# EAGLE design ledcontroller (EAGLE 5.11)
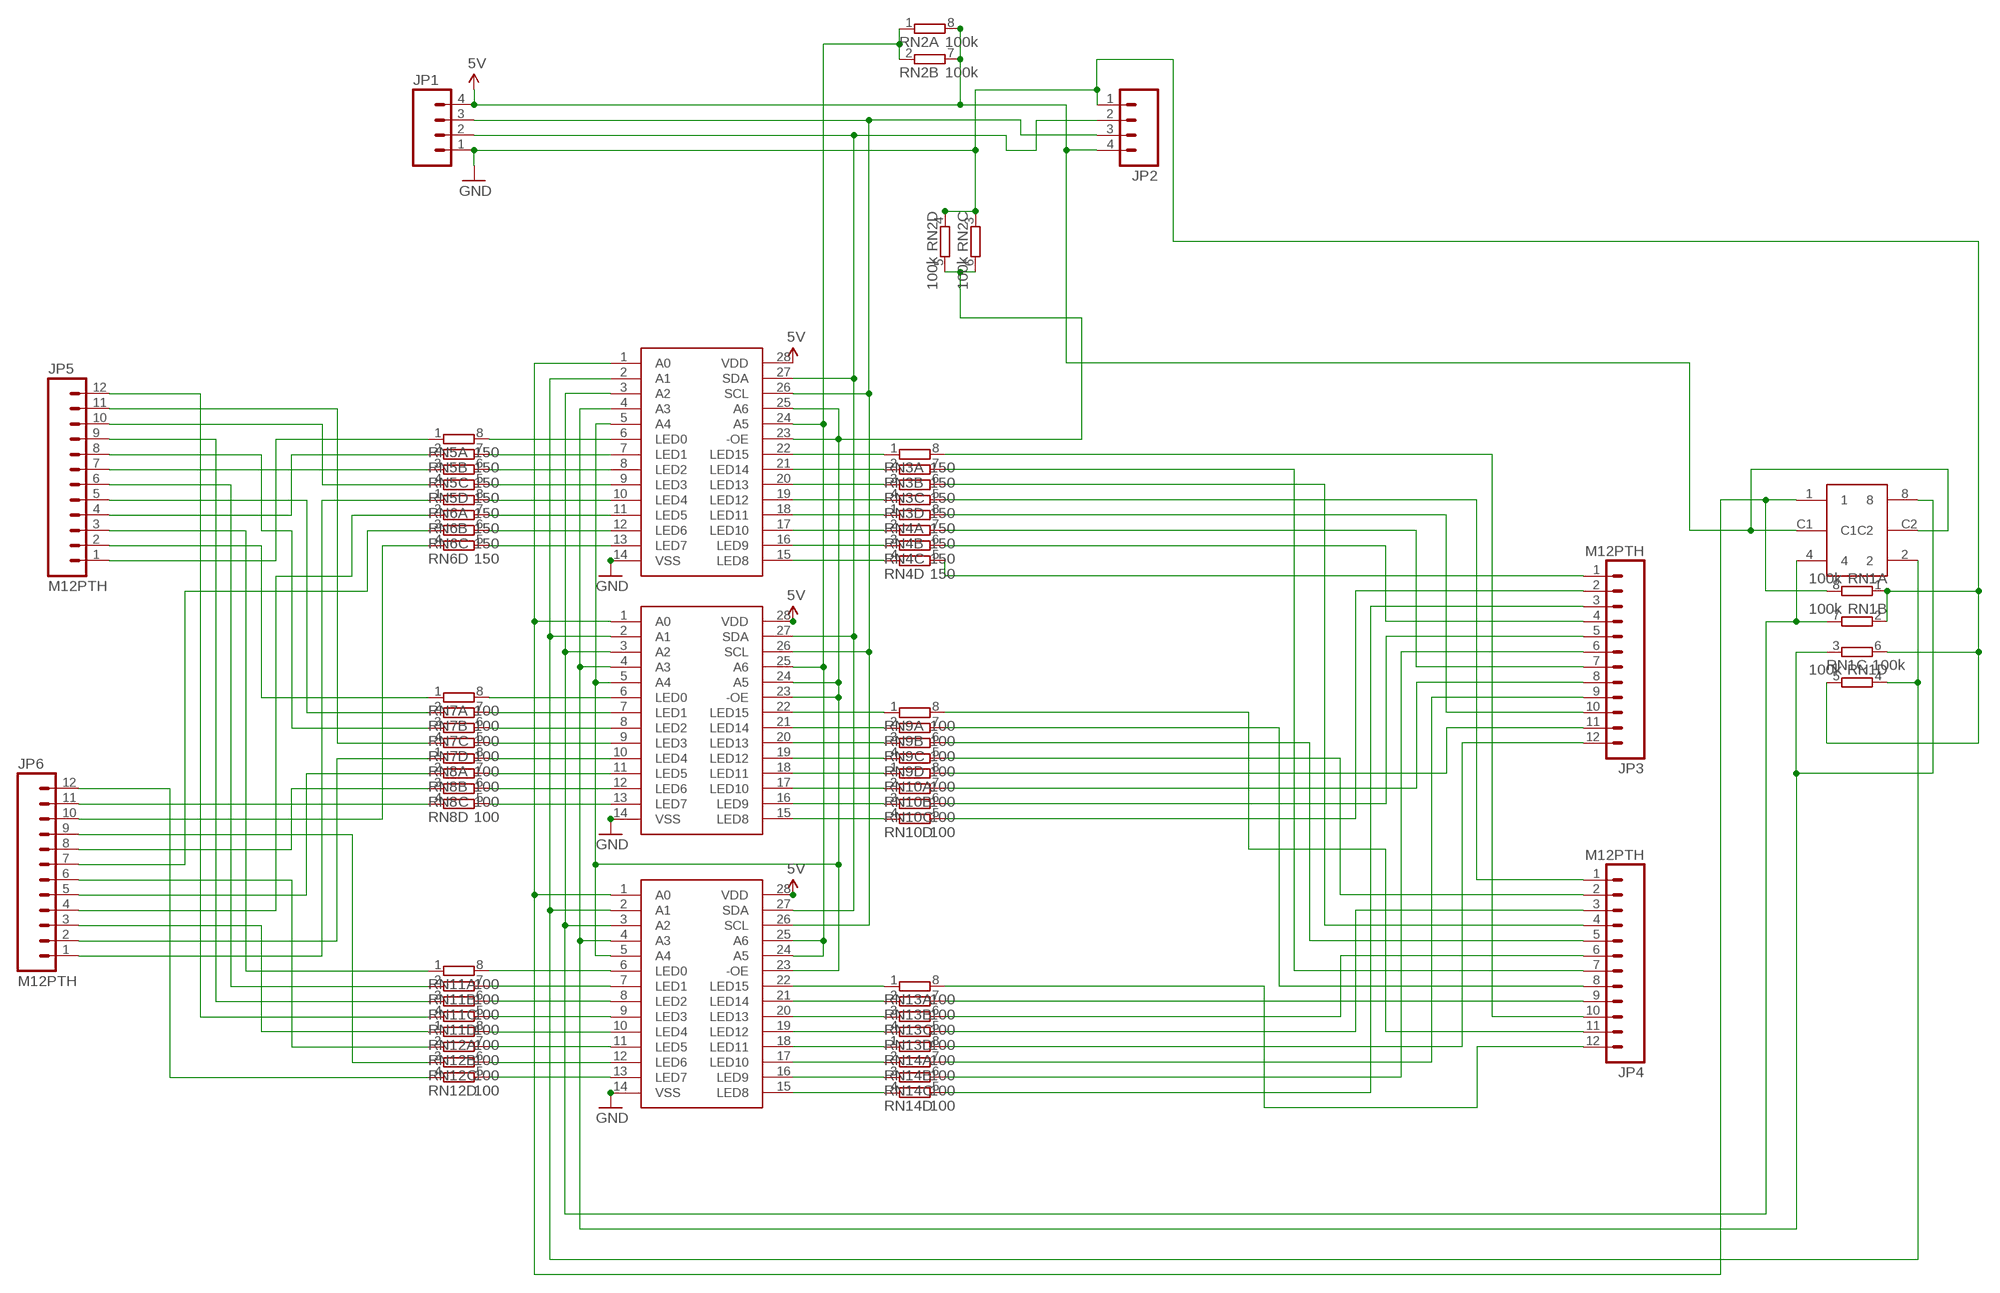
[diagram p0: schematic, sheet 1]

## Parts
DRV_B  PCA9635PWPCA9635PW  [TSSOP28]
DRV_G  PCA9635PWPCA9635PW  [TSSOP28]
DRV_R  PCA9635PWPCA9635PW  [TSSOP28]
JP1  M04PTH  [1X04]
JP2  M04PTH  [1X04]
JP3  M12PTH  [1X12]
JP4  M12PTH  [1X12]
JP5  M12PTH  [1X12]
JP6  M12PTH  [1X12]
RN1  100k  4R-NCAY16  [CAY16]
RN2  100k  4R-NCAY16  [CAY16]
RN3  150  4R-NCAY16  [CAY16]
RN4  150  4R-NCAY16  [CAY16]
RN5  150  4R-NCAY16  [CAY16]
RN6  150  4R-NCAY16  [CAY16]
RN7  100  4R-NCAY16  [CAY16]
RN8  100  4R-NCAY16  [CAY16]
RN9  100  4R-NCAY16  [CAY16]
RN10  100  4R-NCAY16  [CAY16]
RN11  100  4R-NCAY16  [CAY16]
RN12  100  4R-NCAY16  [CAY16]
RN13  100  4R-NCAY16  [CAY16]
RN14  100  4R-NCAY16  [CAY16]
U$4  P36ROTARY  [P36ROTARY-SMD]

## Nets
5V [power]: DRV_B.28(VDD) DRV_G.28(VDD) DRV_R.28(VDD) JP1.4 JP2.4 RN2.7 RN2.8 U$4.C1 U$4.C2
B0: JP5.3 RN11.1
B1: JP5.6 RN11.2
B2: JP5.9 RN11.3
B3: JP5.12 RN11.4
B4: JP6.3 RN12.1
B5: JP6.6 RN12.2
B6: JP6.9 RN12.3
B7: JP6.12 RN12.4
B8: JP3.3 RN14.5
B9: JP3.6 RN14.6
B10: JP3.9 RN14.7
B11: JP3.12 RN14.8
B12: JP4.3 RN13.5
B13: JP4.6 RN13.6
B14: JP4.9 RN13.7
B15: JP4.12 RN13.8
BCD_1: DRV_B.1(A0) DRV_G.1(A0) DRV_R.1(A0) RN1.8 U$4.1
BCD_2: DRV_B.2(A1) DRV_G.2(A1) DRV_R.2(A1) RN1.4 U$4.2
BCD_4: DRV_B.3(A2) DRV_G.3(A2) DRV_R.3(A2) RN1.7 U$4.4
BCD_8: DRV_B.4(A3) DRV_G.4(A3) DRV_R.4(A3) RN1.3 U$4.8
G0: JP5.2 RN7.1
G1: JP5.5 RN7.2
G2: JP5.8 RN7.3
G3: JP5.11 RN7.4
G4: JP6.2 RN8.1
G5: JP6.5 RN8.2
G6: JP6.8 RN8.3
G7: JP6.11 RN8.4
G8: JP3.2 RN10.5
G9: JP3.5 RN10.6
G10: JP3.8 RN10.7
G11: JP3.11 RN10.8
G12: JP4.2 RN9.5
G13: JP4.5 RN9.6
G14: JP4.8 RN9.7
G15: JP4.11 RN9.8
GND [power]: DRV_B.14(VSS) DRV_G.14(VSS) DRV_R.14(VSS) JP1.1 JP2.1 RN1.1 RN1.2 RN1.5 RN1.6 RN2.3 RN2.4
N$1: DRV_R.6(LED0) RN5.8
N$2: DRV_R.7(LED1) RN5.7
N$3: DRV_R.8(LED2) RN5.6
N$4: DRV_R.9(LED3) RN5.5
N$5: DRV_R.10(LED4) RN6.8
N$6: DRV_R.11(LED5) RN6.7
N$7: DRV_R.12(LED6) RN6.6
N$8: DRV_R.13(LED7) RN6.5
N$9: DRV_R.22(LED15) RN3.1
N$10: DRV_R.21(LED14) RN3.2
N$11: DRV_R.20(LED13) RN3.3
N$12: DRV_R.19(LED12) RN3.4
N$17: DRV_G.6(LED0) RN7.8
N$18: DRV_G.8(LED2) RN7.6
N$19: DRV_G.7(LED1) RN7.7
N$20: DRV_G.9(LED3) RN7.5
N$21: DRV_G.10(LED4) RN8.8
N$22: DRV_G.11(LED5) RN8.7
N$23: DRV_G.12(LED6) RN8.6
N$24: DRV_G.13(LED7) RN8.5
N$25: DRV_G.22(LED15) RN9.1
N$26: DRV_G.21(LED14) RN9.2
N$27: DRV_G.20(LED13) RN9.3
N$28: DRV_G.19(LED12) RN9.4
N$29: DRV_G.18(LED11) RN10.1
N$30: DRV_G.17(LED10) RN10.2
N$31: DRV_G.16(LED9) RN10.3
N$32: DRV_G.15(LED8) RN10.4
N$33: DRV_B.22(LED15) RN13.1
N$34: DRV_B.21(LED14) RN13.2
N$35: DRV_B.20(LED13) RN13.3
N$36: DRV_B.19(LED12) RN13.4
N$37: DRV_B.18(LED11) RN14.1
N$38: DRV_B.17(LED10) RN14.2
N$39: DRV_B.16(LED9) RN14.3
N$40: DRV_B.15(LED8) RN14.4
N$41: DRV_B.6(LED0) RN11.8
N$42: DRV_B.7(LED1) RN11.7
N$43: DRV_B.8(LED2) RN11.6
N$44: DRV_B.9(LED3) RN11.5
N$45: DRV_B.10(LED4) RN12.8
N$46: DRV_B.11(LED5) RN12.7
N$47: DRV_B.12(LED6) RN12.6
N$48: DRV_B.13(LED7) RN12.5
PULL-DOWN: DRV_B.5(A4) DRV_B.23(-OE) DRV_G.5(A4) DRV_G.23(-OE) DRV_G.24(A5) DRV_R.5(A4) DRV_R.23(-OE) DRV_R.25(A6) RN2.5 RN2.6
PULL-UP: DRV_B.24(A5) DRV_B.25(A6) DRV_G.25(A6) DRV_R.24(A5) RN2.1 RN2.2
R0: JP5.1 RN5.1
R1: JP5.4 RN5.2
R2: JP5.7 RN5.3
R3: JP5.10 RN5.4
R4: JP6.1 RN6.1
R5: JP6.4 RN6.2
R6: JP6.7 RN6.3
R7: JP6.10 RN6.4
R8: JP3.1 RN4.5
R9: JP3.4 RN4.6
R10: JP3.7 RN4.7
R11: JP3.10 RN4.8
R12: JP4.1 RN3.5
R13: JP4.4 RN3.6
R14: JP4.7 RN3.7
R15: JP4.10 RN3.8
RO8: DRV_R.15(LED8) RN4.4
RO9: DRV_R.16(LED9) RN4.3
RO10: DRV_R.17(LED10) RN4.2
RO11: DRV_R.18(LED11) RN4.1
SCL: DRV_B.26(SCL) DRV_G.26(SCL) DRV_R.26(SCL) JP1.3 JP2.3
SDA: DRV_B.27(SDA) DRV_G.27(SDA) DRV_R.27(SDA) JP1.2 JP2.2

## Library data of the parts
DRV_B DRV_G DRV_R = SparkFun:PCA9635PW: 16ch PWM led driver, 2.3-5.5V
JP1 JP2 = SparkFun:M04: Header 4 Standard 4-pin 0.1" header. Use with straight break away headers (SKU : PRT-00116), right angle break away headers (PRT-00553), swiss pins (PRT-00743), machine pins (PRT-00117), and female headers (PRT-00115). Molex polarized connector foot print use with SKU : PRT-08231 with associated crimp pins and housings.
JP3-JP6 = SparkFun:M12: Header 12 Standard 12-pin 0.1" header. Use with straight break away headers (SKU : PRT-00116), right angle break away headers (PRT-00553), swiss pins (PRT-00743), machine pins (PRT-00117), and female headers (PRT-00115).
RN1-RN14 = resistor-dil:4R-N: Array Chip Resistor Source: RS Component / Phycomp; OC_FARNELL: unknown; OC_NEWARK: unknown
U$4 = SparkFun:P36ROTARY: P36 BCD rotary switch

## Board
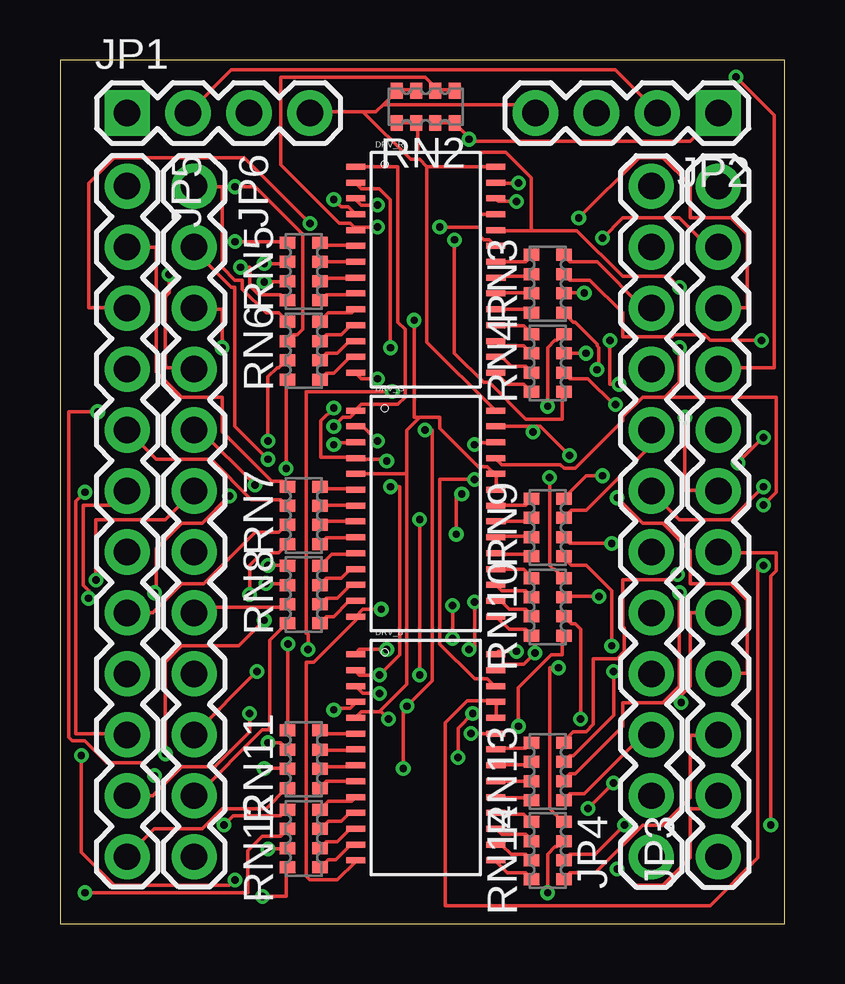
[diagram p1: board, top side]
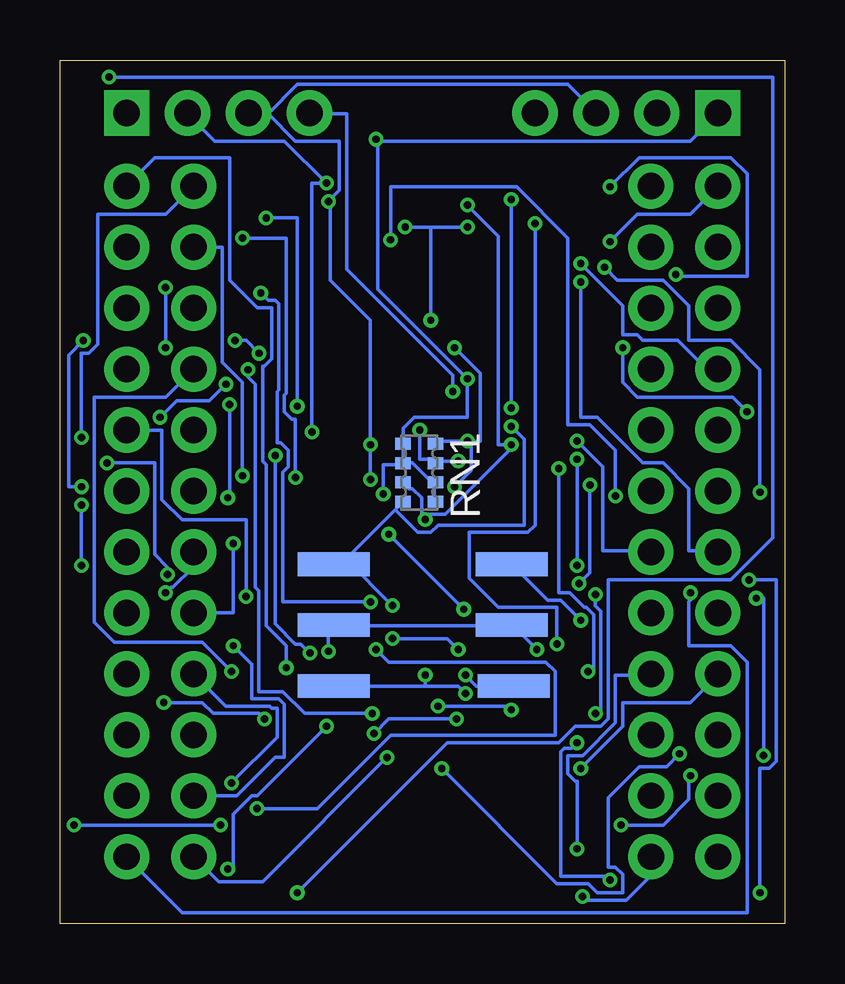
[diagram p2: board, bottom side, seen from below]

Size 30.21 x 35.99 mm. Coordinates in mm from the lower left corner, seen from the top.
Outline: 0,0 30.21,0 30.21,35.99 0,35.99 0,0
Copper layers (1*16): Top 0.035mm / dielectric 1.5mm / Bottom 0.035mm
Design rules "ITead_rule": minimum track width 6mil, minimum drill 12mil, track to track 6mil, track to pad 6mil, pad to pad 6mil, via to via 6mil, smd to smd 0mil, copper to edge 10mil, drill to drill 10mil, minimum pad ring 10mil, minimum via ring 6mil, stop-mask expansion 2mil, vias tented up to drill 100mil, thermal gap 10mil

### Footprints (pad centres in the part's own frame; a part is rotated, then mirrored left to right if it is on the bottom)
TSSOP28 = smd 0.8 x 0.25: 1 -2.921,4.623; 2 -2.921,3.962; 3 -2.921,3.302; 4 -2.921,2.642; 5 -2.921,1.981; 6 -2.921,1.321; 7 -2.921,0.66; 8 -2.927,0; 9 -2.921,-0.66; 10 -2.921,-1.321; 11 -2.921,-1.981; 12 -2.921,-2.642; 13 -2.921,-3.302; 14 -2.921,-3.962; 15 2.921,-3.962; 16 2.921,-3.302; 17 2.921,-2.642; 18 2.921,-1.981; 19 2.921,-1.321; 20 2.921,-0.66; 21 2.927,0; 22 2.921,0.66; 23 2.921,1.321; 24 2.921,1.981; 25 2.921,2.642; 26 2.921,3.302; 27 2.921,3.962; 28 2.921,4.623
1X04 = drill 1.1 pad 1.88 square: 1 0,0 | drill 1.1 pad 1.88 round: 2 2.54,0; 3 5.08,0; 4 7.62,0
1X12 = drill 1.1 pad 1.88 round: 1 0,0; 2 2.54,0; 3 5.08,0; 4 7.62,0; 5 10.16,0; 6 12.7,0; 7 15.24,0; 8 17.78,0; 9 20.32,0; 10 22.86,0; 11 25.4,0; 12 27.94,0
CAY16 = smd 0.5 x 0.65: 1 -1.2,-0.675; 2 -0.4,-0.675; 3 0.4,-0.675; 4 1.2,-0.675; 5 1.2,0.675; 6 0.4,0.675; 7 -0.4,0.675; 8 -1.2,0.675
P36ROTARY-SMD = smd 2.997 x 0.991: 1 0,0; 2 7.493,-5.08; 4 0,-5.08; 8 7.417,0; C1 0,-2.54; C2 7.417,-2.54

### Placement (x,y rotation side)
DRV_B  15.24,6.6 0 top
DRV_G  15.24,16.76 0 top
DRV_R  15.24,26.92 0 top
JP1  2.79,33.78 0 top
JP2  27.43,33.78 180 top
JP3  27.43,2.79 90 top
JP4  24.64,2.79 90 top
JP5  2.79,30.73 270 top
JP6  5.59,30.73 270 top
RN1  15.24,18.8 90 bottom
RN2  15.24,34.04 0 top
RN3  20.32,26.67 270 top
RN4  20.32,23.37 270 top
RN5  10.16,27.18 270 top
RN6  10.16,23.88 270 top
RN7  10.16,17.02 270 top
RN8  10.16,13.72 270 top
RN9  20.32,16.51 270 top
RN10  20.32,13.21 270 top
RN11  10.16,6.86 270 top
RN12  10.16,3.56 270 top
RN13  20.32,6.35 270 top
RN14  20.32,3.05 270 top
U$4  18.8,14.99 0 bottom

### Tracks (layer width: path | path; a pad name or v marks a point on that pad's centre or on a via)
5V  (via drill 0.3)
  Top 0.152: v19.02,11.35 18.26,11.35 18.19,11.28 DRV_B.28 | 15.29,31.55 15.29,24.23 18.11,21.41 DRV_G.28 | 15.29,31.55 DRV_R.28 | RN2.7 14.83,34.75 14.07,34.75 RN2.8 13.99,34.67 13.5,34.18 | 13.5,34.18 13.16,33.83 12.62,33.83 | 12.62,33.83 10.41,33.83 JP1.4 | JP2.4 19.79,33.83 19.48,34.14 13.54,34.14 13.5,34.18 | 15.29,31.55 14.99,31.85 14.61,31.85 12.62,33.83 | v10.34,11.43 10.34,12.04 10.26,12.12 10.26,22.17 v13.84,22.17
  Bottom 0.152: v19.02,11.35 19.02,12.42 18.8,12.42 | 18.8,12.42 11.4,12.42 U$4.C2 11.33,12.42 v10.34,11.43 | 18.8,12.42 U$4.C1 | v13.84,22.17 13.84,22.86 18.26,27.28 18.26,33.76 19.79,33.76 JP2.4
B0  (via drill 0.3)
  Top 0.152: v9.5,11.66 9.5,8.08 RN11.1 | v10.41,29.18 7.67,31.93 2.26,31.93 1.19,30.86 1.19,25.68 2.79,25.68 JP5.3
  Bottom 0.152: v9.5,11.66 9.5,13.18 11.94,13.18 13.16,14.4 13.16,16.31 10.72,16.31 10.41,16.61 v10.41,29.18
B1  (via drill 0.3)
  Top 0.152: v8.66,7.54 9.2,7.54 9.42,7.32 RN11.2 | v7.29,1.83 7.06,1.6 2.26,1.6 0.89,2.97 v0.89,7.01 | v1.19,13.56 1.19,13.87 0.96,14.1 0.96,17.45 2.26,17.45 2.79,17.98 JP5.6
  Bottom 0.152: v8.66,7.54 8.89,7.32 9.2,7.32 9.35,7.16 9.35,1.98 7.44,1.98 v7.29,1.83 | v0.89,7.01 0.89,13.56 v1.19,13.56
B2  (via drill 0.3)
  Top 0.152: v8.51,6.48 9.42,6.48 RN11.3
  Bottom 0.152: v8.51,6.48 6.76,8.23 6.76,9.22 3.94,9.22 2.79,10.36 JP5.9
B3
  Top 0.152: RN11.4 9.42,5.64 8.59,4.8 6.76,4.8 5.92,3.96 3.94,3.96 2.79,2.82 JP5.12
B4  (via drill 0.3)
  Top 0.152: v6.83,4.12 7.21,4.5 9.2,4.5 9.42,4.72 RN12.1 | v3.94,6.17 3.4,6.71 1.96,6.71 1.04,7.62 0.51,7.62 0.36,7.77 0.36,21.34 v1.57,21.34 | v6.76,24 6.76,25.6 5.61,25.6 JP6.3
  Bottom 0.152: v6.83,4.12 5.08,4.12 4.01,5.18 4.01,6.17 v3.94,6.17 | v1.57,21.34 2.18,21.95 6.15,21.95 6.76,22.55 v6.76,24
B5  (via drill 0.3)
  Top 0.152: v1.04,1.29 7.82,1.29 7.82,3.05 8.43,3.66 9.2,3.66 9.42,3.89 RN12.2 | v1.5,14.33 1.5,16.84 4.39,16.84 JP6.6
  Bottom 0.152: v1.04,1.29 1.04,6.48 0.66,6.48 0.36,6.78 0.36,14.33 v1.5,14.33
B6  (via drill 0.3)
  Top 0.152: v8.66,3.12 9.42,3.12 RN12.3
  Bottom 0.152: v8.66,3.12 8.66,5.94 8.74,5.94 9.04,6.25 9.04,7.01 8.43,7.01 7.06,8.38 7.06,10.36 5.61,10.36 JP6.9
B7  (via drill 0.3)
  Top 0.152: v8.43,1.14 9.42,1.14 9.42,2.29 RN12.4
  Bottom 0.152: v8.43,1.14 8.28,0.99 6.6,0.99 5.61,1.98 5.61,2.74 JP6.12
B8
  Top 0.152: RN14.5 21.01,1.91 21.23,2.13 22.3,2.13 24.28,4.12 25.12,4.12 26.26,5.26 26.26,7.85 27.41,7.85 JP3.3
B9  (via drill 0.3)
  Top 0.152: v23.52,4.12 22.3,2.9 21.23,2.9 21.01,2.67 RN14.6 | v29.62,4.12 29.62,14.48 29.84,14.71 29.84,15.47 27.48,15.47 JP3.6
  Bottom 0.152: v23.52,4.12 v29.62,4.12
B10  (via drill 0.3)
  Top 0.152: v20.32,1.29 20.32,2.9 20.62,3.2 20.7,3.2 20.93,3.43 RN14.7 | v28.17,35.28 29.77,33.68 29.77,23.16 27.48,23.16 JP3.9
  Bottom 0.152: v20.32,1.29 14.07,7.54 9.42,7.54 8.74,8.23 7.67,8.23 7.37,8.53 7.37,14.33 2.26,14.33 0.51,16.08 0.51,35.28 v28.17,35.28
B11  (via drill 0.3)
  Top 0.152: v20.78,10.67 20.4,10.67 20.4,4.8 20.93,4.27 RN14.8
  Bottom 0.152: v20.78,10.67 20.78,11.58 21.61,12.42 21.61,19.13 21.77,19.28 21.77,23.24 21.69,23.24 21.39,23.55 21.39,25.68 22,25.68 23.14,26.82 23.14,31.93 26.26,31.93 27.41,30.79 JP3.12
B12
  Top 0.152: RN13.5 21.01,5.18 21.23,5.41 21.84,5.41 24.28,7.85 24.59,7.85 JP4.3
B13  (via drill 0.3)
  Top 0.152: v25.81,13.79 25.81,9.91 25.12,9.22 23.44,9.22 23.44,8.23 21.46,6.25 21.23,6.25 21.01,6.02 RN13.6
  Bottom 0.152: v25.81,13.79 25.58,14.02 25.5,14.02 24.66,14.86 24.66,15.47 JP4.6
B14  (via drill 0.3)
  Top 0.152: v23.06,10.52 23.06,8.69 21.39,7.01 21.23,7.01 21.01,6.78 RN13.7
  Bottom 0.152: v23.06,10.52 24.28,11.73 27.94,11.73 28.78,12.57 28.78,21.95 25.81,21.95 JP4.9
B15  (via drill 0.3)
  Top 0.152: v25.73,14.55 25.5,14.33 23.44,14.33 23.44,12.42 23.52,12.34 23.52,11.35 23.22,11.05 22.23,11.05 22.23,8.31 21.92,8 21.39,8 21.01,7.62 RN13.8 | v28.25,19.2 v29.31,20.27
  Bottom 0.152: v25.73,14.55 25.73,14.86 26.26,15.39 26.26,19.2 v28.25,19.2 | v29.31,20.27 29.31,23.77 29.01,23.77 28.63,24.16 28.63,29.57 25.81,29.57 JP4.12
BCD_1  (via drill 0.3)
  Top 0.152: DRV_R.1 14.07,31.55 14.07,25.07 14.38,24.77 14.38,21.95 14.07,21.64 12.55,21.64 12.32,21.41 DRV_G.1 12.32,21.34 12.09,21.11 11.79,21.11 v11.4,20.73 | v13.61,11.43 12.47,11.43 12.32,11.28 DRV_B.1 | v16.36,11.89 v16.36,13.26
  Bottom 0.152: 16.24,17.26 18.49,15.01 18.8,15.01 U$4.1 18.26,15.16 v16.36,13.26 | 16.24,17.26 15.98,17.53 RN1.8 | v13.61,11.43 14.07,11.89 v16.36,11.89 | v11.4,20.73 10.87,20.19 10.87,16.61 14.45,16.61 14.76,16.31 15.29,16.31 16.24,17.26
BCD_2  (via drill 0.3)
  Top 0.152: DRV_B.2 12.32,10.52 12.47,10.36 v13.31,10.36 14.15,11.2 14.15,18.21 v13.77,18.21 | v13.23,20.12 12.62,20.73 DRV_G.2 | v13.77,24 13.77,30.18 13.31,30.63 12.55,30.63 12.32,30.86 DRV_R.2
  Bottom 0.152: v13.31,10.36 12.85,9.91 U$4.2 | RN1.4 14.53,20.04 14.45,20.12 v13.23,20.12 13.08,20.12 | v13.77,24 12.7,22.94 12.7,20.12 13.08,20.12 | v13.77,18.21 13.08,18.9 13.08,20.12
BCD_4  (via drill 0.3)
  Top 0.152: DRV_B.3 12.62,9.6 v13.31,9.6 | v11.4,19.96 11.48,20.04 12.32,20.04 DRV_G.3 | v13.23,29.95 12.55,29.95 12.32,30.18 DRV_R.3 | v14.99,10.36 v14.99,16.84
  Bottom 0.152: v13.31,9.6 13.61,9.91 14.99,9.91 | 14.99,9.91 U$4.4 | 14.99,17.07 14.15,17.07 11.4,19.81 v11.4,19.96 11.94,19.96 11.94,28.65 v13.23,29.95 | 14.99,17.07 15.14,17.07 15.14,17.75 15.52,18.14 15.67,18.14 15.9,18.36 RN1.7 | 14.99,9.91 v14.99,10.36 | v14.99,16.84 14.99,17.07
BCD_8  (via drill 0.3)
  Top 0.152: v13.61,19.28 13.54,19.36 12.32,19.36 DRV_G.4 12.32,19.43 10.87,19.43 10.87,20.95 v11.4,21.49 | v11.4,8.91 11.48,8.99 12.09,8.99 12.32,9.22 DRV_B.4 | v15.21,20.57 15.52,20.57 15.52,10.13 v14.45,9.07 14.3,9.07 v14.3,6.48 | DRV_R.4 12.01,29.87 11.71,29.87 v11.4,30.18 | v8.51,12.65 7.44,11.58 5.08,11.58 4.39,10.9 v4.39,7.09
  Bottom 0.152: v13.61,19.28 14.45,19.28 14.53,19.2 RN1.3 14.61,19.2 14.76,19.36 15.21,19.36 v15.21,20.57 | v11.4,8.91 11.56,9.07 v14.45,9.07 | v11.4,21.49 v11.4,30.18 | v8.51,12.65 9.35,13.49 9.88,13.49 U$4.8 | v4.39,7.09 4.93,6.55 6.07,6.55 7.37,5.26 7.37,2.36 7.06,2.36 6.76,2.06 6.76,1.29 7.82,1.29 8.2,1.68 9.5,1.68 v14.3,6.48
G0
  Top 0.152: JP5.2 4.01,28.19 4.01,23.01 5.08,21.95 6.76,21.95 6.76,20.5 8.81,18.44 9.27,18.44 9.42,18.29 RN7.1
G1
  Top 0.152: JP5.5 4.01,19.36 6.3,19.36 7.98,17.68 9.2,17.68 9.42,17.45 RN7.2
G2
  Top 0.152: JP5.8 3.86,12.95 5.08,14.17 5.99,14.17 8.13,16.31 9.12,16.31 9.42,16.61 RN7.3
G3  (via drill 0.3)
  Top 0.152: v7.9,13.72 7.9,14.94 8.43,15.47 9.12,15.47 9.42,15.77 RN7.4 | v7.9,8.76 7.9,8 6.45,6.55 5.08,6.55 3.86,5.33 JP5.11
  Bottom 0.152: v7.9,13.72 7.9,13.26 7.67,13.03 7.67,8.76 v7.9,8.76
G4  (via drill 0.3)
  Top 0.152: v8.66,14.94 9.42,14.94 RN8.1 | v8.66,19.36 7.29,20.73 7.29,26.52 7.14,26.52 5.61,28.04 5.61,28.19 JP6.2
  Bottom 0.152: v8.66,14.94 v8.66,19.36
G5  (via drill 0.3)
  Top 0.152: v8.59,14.17 9.42,14.17 RN8.2 | v8.13,18.29 5.84,20.57 JP6.5
  Bottom 0.152: v8.59,14.17 8.13,14.63 v8.13,18.29
G6
  Top 0.152: RN8.3 9.42,13.26 9.35,13.18 5.84,13.18 5.61,12.95 JP6.8
G7
  Top 0.152: RN8.4 9.42,12.5 8.74,11.81 8.74,8.08 8.43,8.08 5.69,5.33 JP6.11
G8  (via drill 0.3)
  Top 0.152: v19.1,8.23 19.1,9.83 20.47,11.2 20.93,11.2 20.93,11.96 RN10.5 | v23.22,2.29 23.9,1.6 25.12,1.6 26.26,2.74 26.26,4.8 26.87,4.8 27.41,5.33 JP3.2
  Bottom 0.152: v19.1,8.23 22,5.33 22.23,5.33 22.99,4.57 22.99,2.29 v23.22,2.29
G9  (via drill 0.3)
  Top 0.152: v21.69,8.53 21.69,12.27 21.46,12.5 21.31,12.5 RN10.6 | v25.88,9.22 25.88,9.53 26.26,9.91 26.26,12.95 JP3.5
  Bottom 0.152: v21.69,8.53 21.92,8.76 23.82,8.76 24.28,9.22 v25.88,9.22
G10  (via drill 0.3)
  Top 0.152: v22.45,13.64 21.01,13.64 RN10.7
  Bottom 0.152: v22.45,13.64 22.45,16.84 25.12,16.84 25.96,17.68 25.96,20.57 JP3.8
G11  (via drill 0.3)
  Top 0.152: v20.4,18.59 20.4,14.94 20.55,14.78 20.62,14.78 20.93,14.48 RN10.8 | v22.61,28.57 23.44,29.41 25.81,29.41 27.03,28.19 JP3.11
  Bottom 0.152: v20.4,18.59 20.4,21.03 20.55,21.03 20.85,21.34 20.85,22.02 20.78,22.1 20.78,28.57 v22.61,28.57
G12  (via drill 0.3)
  Top 0.152: v22.99,11.58 22.99,13.87 21.92,14.94 21.31,14.94 21.01,15.24 RN9.5
  Bottom 0.152: v22.99,11.58 22.23,10.82 22.23,9.37 21.08,9.37 20.85,9.14 20.85,6.93 21.23,6.93 22.84,5.33 JP4.2
G13  (via drill 0.3)
  Top 0.152: v22.99,15.85 21.23,15.85 21.01,16.08 RN9.6
  Bottom 0.152: v22.99,15.85 22.99,12.95 JP4.5
G14
  Top 0.152: RN9.7 21.31,17.22 21.92,17.22 24.59,19.89 24.59,20.57 JP4.8
G15  (via drill 0.3)
  Top 0.152: v22.61,18.67 21.92,18.67 21.01,17.75 RN9.8
  Bottom 0.152: v22.61,18.67 22.61,22.55 23.44,23.39 23.44,28.19 JP4.11
GND  (via drill 0.3)
  Top 0.152: RN2.3 15.67,33.38 16.43,33.38 RN2.4 16.51,33.3 17.08,32.73 | 17.08,32.73 17.2,32.61 26.26,32.61 JP2.1 | DRV_B.14 12.32,2.59 11.56,1.83 10.41,1.83 10.26,1.98 10.26,10.9 10.57,10.9 12.32,12.65 DRV_G.14 12.62,13.11 v13.39,13.11 | v13.23,22.71 12.55,22.71 12.32,22.94 DRV_R.14 | v16.51,16.23 16.51,17.91 v16.74,17.91 | v17.04,32.69 17.08,32.73
  Bottom 0.152: RN1.1 14.61,17.6 14.61,18.36 RN1.2 14.68,18.36 15.52,19.2 15.82,19.2 RN1.6 | RN1.6 15.9,19.2 15.9,19.96 RN1.5 15.9,20.04 15.9,20.65 15.44,21.11 13.23,21.11 v13.23,22.71 16.97,26.44 16.97,32.61 | 16.97,32.61 3.94,32.61 2.79,33.76 JP1.1 | v13.39,13.11 v16.51,16.23 | v16.74,17.91 16.74,19.13 15.98,19.13 RN1.6 | 16.97,32.61 v17.04,32.69
N$1
  Top 0.152: RN5.8 10.87,28.35 10.95,28.27 12.32,28.27 DRV_R.6
N$2
  Top 0.152: DRV_R.7 10.87,27.58 RN5.7
N$3
  Top 0.152: RN5.6 10.87,26.82 10.95,26.9 12.24,26.9 DRV_R.8
N$4
  Top 0.152: RN5.5 10.87,25.98 11.1,26.21 12.32,26.21 DRV_R.9
N$5
  Top 0.152: DRV_R.10 12.17,25.45 11.18,25.45 10.87,25.15 RN6.8
N$6
  Top 0.152: RN6.7 10.87,24.31 11.1,24.54 11.71,24.54 12.09,24.92 12.32,24.92 DRV_R.11
N$7
  Top 0.152: RN6.6 10.87,23.55 11.1,23.77 11.56,23.77 12.01,24.23 12.32,24.23 DRV_R.12
N$8
  Top 0.152: DRV_R.13 12.09,23.62 11.4,22.94 11.1,22.94 10.87,22.71 RN6.5
N$9
  Top 0.152: RN3.1 19.63,27.81 19.41,27.58 DRV_R.22
N$10
  Top 0.152: RN3.2 19.63,27.05 19.56,26.98 18.19,26.98 DRV_R.21
N$11
  Top 0.152: RN3.3 19.63,26.29 18.19,26.29 DRV_R.20
N$12
  Top 0.152: RN3.4 19.63,25.53 19.56,25.6 DRV_R.19
N$17
  Top 0.152: RN7.8 10.87,18.21 10.95,18.14 12.32,18.14 DRV_G.6
N$18
  Top 0.152: RN7.6 10.87,16.69 10.95,16.76 DRV_G.8
N$19
  Top 0.152: RN7.7 10.87,17.45 12.32,17.45 DRV_G.7
N$20
  Top 0.152: RN7.5 10.87,15.85 11.1,16.08 12.32,16.08 DRV_G.9
N$21
  Top 0.152: RN8.8 10.87,14.94 11.33,15.39 12.32,15.39 DRV_G.10
N$22
  Top 0.152: DRV_G.11 12.09,14.78 11.71,14.4 11.1,14.4 10.87,14.17 RN8.7
N$23
  Top 0.152: RN8.6 10.87,13.34 11.1,13.56 11.56,13.56 12.09,14.1 12.32,14.1 DRV_G.12
N$24
  Top 0.152: RN8.5 10.87,12.57 11.1,12.8 11.4,12.8 12.01,13.41 12.32,13.41 DRV_G.13
N$25
  Top 0.152: RN9.1 19.63,17.68 19.41,17.45 18.19,17.45 DRV_G.22
N$26
  Top 0.152: RN9.2 19.63,16.84 19.56,16.76 DRV_G.21
N$27
  Top 0.152: RN9.3 19.63,16.15 18.19,16.15 DRV_G.20
N$28
  Top 0.152: RN9.4 19.56,15.39 18.19,15.39 DRV_G.19
N$29
  Top 0.152: RN10.1 19.63,14.48 19.33,14.78 DRV_G.18
N$30
  Top 0.152: RN10.2 19.63,13.64 19.41,13.87 18.41,13.87 DRV_G.17
N$31
  Top 0.152: RN10.3 19.63,12.88 19.41,13.11 18.72,13.11 18.41,13.41 18.19,13.41 DRV_G.16
N$32
  Top 0.152: RN10.4 19.63,12.04 19.41,12.27 18.72,12.27 18.19,12.8 DRV_G.15
N$33
  Top 0.152: RN13.1 19.41,7.32 18.19,7.32 DRV_B.22
N$34
  Top 0.152: RN13.2 19.63,6.71 19.56,6.63 18.19,6.63 DRV_B.21
N$35
  Top 0.152: RN13.3 DRV_B.20
N$36
  Top 0.152: RN13.4 19.63,5.18 19.56,5.26 18.19,5.26 DRV_B.19
N$37
  Top 0.152: RN14.1 19.63,4.27 19.33,4.57 18.19,4.57 DRV_B.18
N$38
  Top 0.152: RN14.2 19.63,3.5 19.41,3.73 18.41,3.73 18.19,3.96 DRV_B.17
N$39
  Top 0.152: RN14.3 19.63,2.67 19.41,2.9 18.8,2.9 18.41,3.28 18.19,3.28 DRV_B.16
N$40
  Top 0.152: RN14.4 19.63,1.91 19.41,2.13 18.64,2.13 18.19,2.59 DRV_B.15
N$41
  Top 0.152: DRV_B.6 10.95,7.92 10.87,8 RN11.8
N$42
  Top 0.152: RN11.7 10.87,7.24 12.32,7.24 DRV_B.7
N$43
  Top 0.152: RN11.6 10.87,6.48 10.95,6.55 12.24,6.55 DRV_B.8
N$44
  Top 0.152: DRV_B.9 11.1,5.94 10.87,5.71 RN11.5
N$45
  Top 0.152: RN12.8 10.87,4.8 11.18,5.11 12.17,5.11 12.32,5.26 DRV_B.10
N$46
  Top 0.152: RN12.7 10.87,3.96 11.18,4.27 11.71,4.27 12.01,4.57 12.32,4.57 DRV_B.11
N$47
  Top 0.152: DRV_B.12 12.09,3.96 11.56,3.43 11.1,3.43 10.87,3.2 RN12.6
N$48
  Top 0.152: RN12.5 10.87,2.36 11.18,2.67 11.48,2.67 12.09,3.28 12.32,3.28 DRV_B.13
PULL-DOWN  (via drill 0.3)
  Top 0.152: 17.5,29.03 17.5,29.57 DRV_R.25 | 17.5,29.03 17.5,28.65 17.65,28.5 17.88,28.5 18.11,28.27 DRV_R.23 | RN2.5 16.43,34.75 15.67,34.75 RN2.6 15.67,34.82 15.21,35.28 9.2,35.28 9.2,31.62 11.63,29.18 12.09,29.18 12.28,28.99 | 12.28,28.99 12.32,28.96 DRV_R.5 | v15.82,29.03 17.5,29.03 | v13.23,29.03 12.32,29.03 12.28,28.99 | DRV_G.23 18.19,18.14 18.19,18.75 DRV_G.24 18.11,18.75 17.8,19.05 17.42,19.05 15.82,20.65 15.82,21.11 14.99,21.11 14.95,21.07 | 13.35,8.88 14.45,9.98 14.45,18.75 | 13.35,8.88 13.31,8.84 12.55,8.84 12.32,8.61 DRV_B.5 | 14.45,18.75 DRV_G.5 | v17.12,7.92 DRV_B.23 | 13.35,8.88 v13.69,8.53 | 14.95,21.07 14.45,20.57 14.45,18.75 | v14.76,25.15 14.76,21.11 14.91,21.11 14.95,21.07
  Bottom 0.152: 14.76,29.03 v13.23,29.03 | 14.76,29.03 v15.82,29.03 | v17.12,7.92 16.51,8.53 v13.69,8.53 | v14.76,25.15 14.76,29.03
PULL-UP  (via drill 0.3)
  Top 0.152: DRV_B.24 18.19,8.61 18.19,9.22 DRV_B.25 18.11,9.3 16.97,9.3 16.05,8.38 16.05,0.76 27.1,0.76 29.08,2.74 29.08,14.94 v29.31,14.94 | RN2.1 14.07,33.38 14.83,33.38 RN2.2 14.91,33.3 14.91,32.16 18.57,32.16 19.63,31.09 19.63,28.88 | 25.23,21.98 25.81,22.55 v25.81,24 | 25.23,21.98 25.2,21.95 24.28,21.95 23.52,21.18 23.44,21.18 23.44,20.95 21.46,18.97 21.01,18.97 20.85,19.13 18.41,19.13 18.19,19.36 DRV_G.25 | v25.81,26.52 25.35,26.98 23.44,26.98 21.54,28.88 19.63,28.88 | 19.63,28.88 18.19,28.88 DRV_R.24 | v29.31,17.45 29.84,17.98 29.84,21.95 25.27,21.95 25.23,21.98
  Bottom 0.152: v25.81,24 v25.81,26.52 | v29.31,14.94 v29.31,17.45
R0  (via drill 0.3)
  Top 0.152: v7.29,28.42 9.42,28.42 RN5.1
  Bottom 0.152: v7.29,28.42 6.15,29.57 3.94,29.57 2.79,30.71 JP5.1
R1  (via drill 0.3)
  Top 0.152: v8.51,27.51 9.42,27.51 RN5.2
  Bottom 0.152: v8.51,27.51 6.76,25.76 6.76,24.54 6.15,24.54 5.92,24.31 4.47,24.31 3.33,23.16 2.79,23.16 JP5.4
R2  (via drill 0.3)
  Top 0.152: v8.51,26.75 9.42,26.75 RN5.3
  Bottom 0.152: v8.51,26.75 8.51,21.11 7.82,21.11 5.92,19.2 5.08,19.2 4.01,18.14 4.01,15.54 2.79,15.54 JP5.7
R3  (via drill 0.3)
  Top 0.152: v7.52,27.36 7.9,27.36 7.9,26.59 8.28,26.21 9.2,26.21 9.42,25.98 RN5.4 | v1.04,17.98 0.66,17.6 0.66,7.92 2.79,7.92 JP5.10
  Bottom 0.152: v7.52,27.36 6.99,26.82 5.08,26.82 4.01,25.76 4.01,24.31 2.26,24.31 1.04,23.09 v1.04,17.98
R4
  Top 0.152: RN6.1 9.42,25.15 9.12,25.45 8.59,25.45 7.59,26.44 7.59,26.82 7.29,26.82 6.76,27.36 6.76,30.71 5.61,30.71 JP6.1
R5  (via drill 0.3)
  Top 0.152: v7.29,30.71 8.13,30.71 10.11,28.73 10.11,24.77 9.88,24.54 9.73,24.54 9.5,24.31 RN6.2 | v4.55,27.05 4.55,26.29 4.39,26.14 4.39,23.16 5.54,23.16 JP6.4
  Bottom 0.152: v7.29,30.71 6.07,31.93 2.26,31.93 1.57,31.24 1.57,26.98 4.47,26.98 v4.55,27.05
R6  (via drill 0.3)
  Top 0.152: v8.66,20.12 8.66,22.78 9.04,23.16 9.12,23.16 9.42,23.47 RN6.3
  Bottom 0.152: v8.66,20.12 7.59,19.05 7.59,15.54 5.61,15.54 JP6.7
R7  (via drill 0.3)
  Top 0.152: v9.42,18.97 9.42,22.63 RN6.4 | v8.2,10.52 5.61,7.92 JP6.10
  Bottom 0.152: v9.42,18.97 9.42,13.79 8.97,13.79 8.36,13.18 8.28,13.18 7.98,12.88 7.98,10.52 v8.2,10.52
R8  (via drill 0.3)
  Top 0.152: v16.43,28.5 16.43,23.77 17.65,22.55 17.88,22.55 19.41,21.03 20.93,21.03 20.93,22.1 RN4.5 | v7.06,17.83 5.92,16.69 5.08,16.69 4.01,15.62 4.01,13.79 v3.94,13.79
  Bottom 0.152: v16.43,28.5 16.43,30.71 11.18,30.71 9.04,28.57 9.04,20.8 8.13,20.8 7.06,19.74 v7.06,17.83 | v3.94,13.79 3.94,13.49 4.01,13.41 4.01,11.58 2.26,11.58 1.57,10.9 1.57,0.46 25.12,0.46 27.41,2.74 JP3.1
R9  (via drill 0.3)
  Top 0.152: v23.14,21.64 23.06,21.64 22,22.71 21.23,22.71 21.01,22.94 RN4.6 | v23.22,17.75 24.28,16.69 25.12,16.69 26.26,15.54 26.26,14.17 27.94,14.17 28.63,13.49 28.63,10.44 27.48,10.44 JP3.4
  Bottom 0.152: v23.14,21.64 23.14,17.75 v23.22,17.75
R10  (via drill 0.3)
  Top 0.152: v21.92,23.77 RN4.7 | v22.91,24.31 22.91,22.48 v23.29,22.48 | v26.04,21.11 26.04,18.06 27.41,18.06 JP3.7
  Bottom 0.152: v21.92,23.77 22.45,24.31 v22.91,24.31 | v23.29,22.48 23.98,21.79 25.35,21.79 v26.04,21.11
R11  (via drill 0.3)
  Top 0.152: v20.32,21.57 20.32,24 20.62,24.31 20.7,24.31 20.93,24.54 RN4.8 | v21.61,29.41 24.13,31.93 25.12,31.93 26.26,30.79 26.26,29.41 27.94,29.41 28.63,28.73 28.63,25.68 27.48,25.68 JP3.10
  Bottom 0.152: v20.32,21.57 20.32,29.41 v21.61,29.41
R12  (via drill 0.3)
  Top 0.152: v22.38,23.09 22.45,23.09 22.45,24 22.38,24.08 22.38,24.16 21.46,25.07 21.39,25.07 21.01,25.45 RN3.5 | v17.2,8.76 16.59,8.15 v16.59,6.93
  Bottom 0.152: v22.38,23.09 22.38,22.78 22.07,22.48 22.07,14.02 21.92,13.87 21.92,9.68 20.93,9.68 20.02,8.76 v17.2,8.76 | v16.59,6.93 21.77,1.75 23.6,1.75 JP4.1
R13  (via drill 0.3)
  Top 0.152: v21.84,26.29 21.01,26.29 RN3.6 | v17.27,13.41 17.27,11.43 v17.04,11.43 | v22,4.8 v23.06,5.87
  Bottom 0.152: v21.84,26.29 21.54,25.98 21.23,25.98 21.08,25.83 21.08,22.25 21.16,22.17 21.16,20.04 21.01,20.04 20.7,19.74 20.7,19.05 20.93,18.82 20.93,13.41 v17.27,13.41 | v17.04,11.43 16.51,10.9 9.96,10.9 9.58,10.52 9.58,7.85 16.43,7.85 19.48,4.8 v22,4.8 | v23.06,5.87 21.16,7.77 21.16,8.99 21.39,8.99 21.46,9.07 23.29,9.07 JP4.4
R14  (via drill 0.3)
  Top 0.152: v29.23,24.31 27.1,24.31 26.87,24.54 25.58,24.54 25.5,24.46 23.44,24.46 23.44,25.45 22.07,26.82 21.23,26.82 21.01,27.05 RN3.7 | v29.31,18.21 27.94,16.84 25.81,16.84 24.66,17.98 JP4.7
  Bottom 0.152: v29.23,24.31 29.84,23.7 29.84,18.21 v29.31,18.21
R15
  Top 0.152: RN3.8 21.01,27.81 21.23,27.58 22.38,27.58 24.28,25.68 24.59,25.68 JP4.10
RO8
  Top 0.152: RN4.4 19.33,22.48 18.64,22.48 DRV_R.15
RO9
  Top 0.152: RN4.3 19.63,23.01 19.41,23.24 18.8,23.24 18.41,23.62 DRV_R.16
RO10
  Top 0.152: RN4.2 19.33,24.08 18.34,24.08 18.19,24.23 DRV_R.17
RO11
  Top 0.152: RN4.1 19.63,24.61 19.33,24.92 18.19,24.92 DRV_R.18
SCL  (via drill 0.3)
  Top 0.152: v17.27,18.52 15.82,18.52 15.82,11.66 17.27,10.21 17.8,10.21 18.11,9.91 DRV_B.26 | v17.27,19.96 17.35,20.04 18.11,20.04 DRV_G.26 | v19.02,30.1 18.26,30.1 18.19,30.18 DRV_R.26
  Bottom 0.152: v17.27,18.52 v17.27,19.96 17.27,25.15 18.95,26.82 18.95,30.1 v19.02,30.1 18.57,30.56 18.57,32.61 20.4,32.61 21.54,33.76 | 21.54,33.76 22.3,33.76 JP2.3 21.54,33.76 | 21.54,33.76 20.32,34.98 9.04,34.98 7.9,33.83 JP1.3
SDA  (via drill 0.3)
  Top 0.152: v19.79,11.28 19.33,10.82 18.41,10.82 DRV_B.27 | v21.23,19.51 20.02,20.73 19.71,20.73 | 19.71,20.73 DRV_G.27 | v19.1,30.86 18.19,30.86 DRV_R.27 | JP1.2 7.14,35.59 23.14,35.59 24.89,33.83 JP2.2 | 19.71,20.73 v19.71,20.5
  Bottom 0.152: v19.79,11.28 20.17,11.66 20.4,11.66 21.23,12.5 v21.23,19.51 | JP2.2 24.89,33.76 23.75,32.61 20.85,32.61 v19.1,30.86 19.71,30.86 v19.71,20.5